# Altium schematic sheet Port.SchDoc
size A4; SheetNumber: 1; SheetTotal: 1
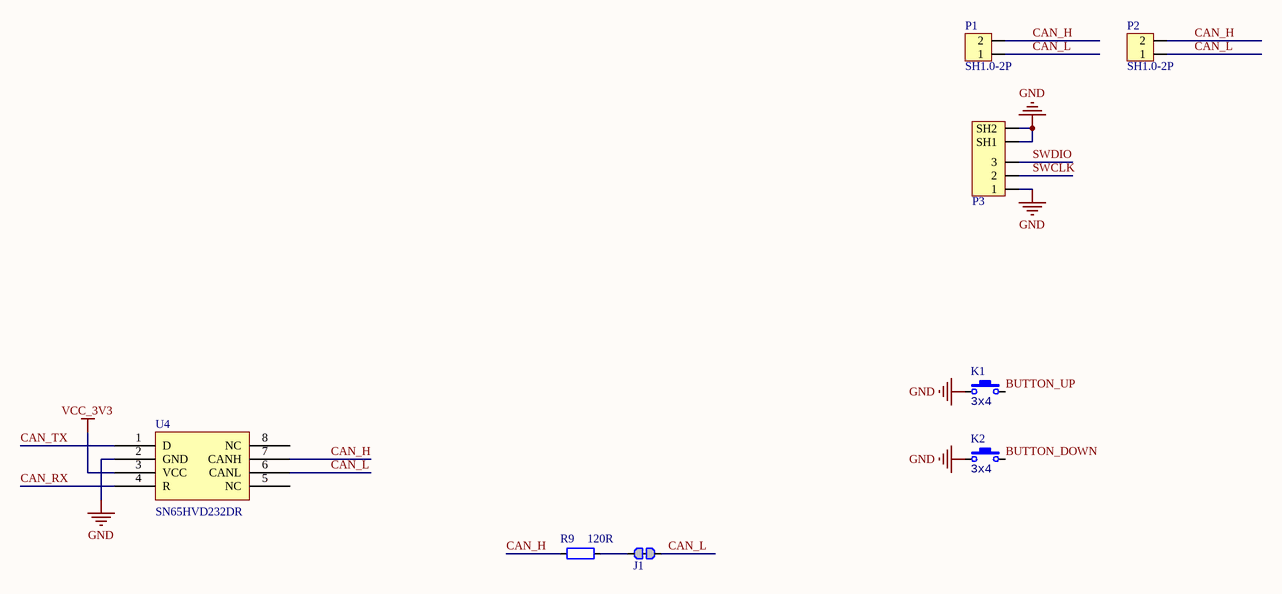
[diagram p0: Port.SchDoc]

## Parts
J1  跳线  [0402-0R]  (value not drawn)
K1  value 3x4  [ButtonTACT_3x4x2_180]  (hidden comment: TACT 2P)
K2  value 3x4  [ButtonTACT_3x4x2_180]  (hidden comment: TACT 2P)
P1  SH1.0-2P  [SH1.0-2P]
P2  SH1.0-2P  [SH1.0-2P]
P3  SH1.0-3P  [SH1.0-3P]  (value not drawn)
R9  120R  [RES_0402]
U4  Manufacturer Part Number: SN65HVD232DR  [SO-8]  (hidden comment: SN65HVD232D)

## Nets
GND: K1.1 K2.1 P3.1 P3.SH1 P3.SH2 U4.2(GND)
VCC_3V3: U4.3(VCC)
BUTTON_DOWN: K2.2
BUTTON_UP: K1.2
CAN_H: P1.2 P2.2 R9.1 U4.7(CANH)
CAN_L: J1.2 P1.1 P2.1 U4.6(CANL)
CAN_RX: U4.4(R)
CAN_TX: U4.1(D)
SWCLK: P3.2
SWDIO: P3.3
NetJ1_1: J1.1 R9.2

Not connected (* = marked no-connect by the designer): U4 5(NC) 8(NC)

## Library data of the parts
J1 = 跳线: Resistor; Published: 8-Jun-2000; LatestRevisionDate: 17-Jul-2002; LatestRevisionNote: Re-released for DXP Platform.; PackageReference: AXIAL-0.4; Publisher: Altium Limited; PackageDescription: Axial Device, Thru-Hole; 2 Leads; 0.4 in Pin Spacing
K1 K2 = ButtonTACT_3x4x2_180: Button; type: TACT 2P
P3 = SH1.0-3P: Header
R9 = 电阻-0402: Resistor; Value: 22R
U4 = SN65HVD232D: Manufacturer: Texas Instruments; Protocol: CAN; Number of Drivers/Receivers: 1/1; Duplex: Half; Data Rate: 1Mbps; Voltage - Supply: 3 V ~ 3.6 V; Supplier 1: Digi-Key; Supplier Part Number 1: 296-26344-2-ND; RoHS: RoHS Compliant; Category: Integrated Circuits (ICs); Stock: 5000; Pricing 1: 2500=0.84375 (USD); Packaging: Tape & Reel (TR); Part Status: Active; Type: Transceiver; Operating Temperature: -40°C ~ 85°C; Mounting Type: Surface Mount; Package / Case: 8-SOIC (0.154", 3.90mm Width); Supplier Device Package: 8-SOIC; ComponentLink1URL: http://www.ti.com/lit/ds/symlink/sn65hvd230.pdf; ComponentLink1Description: http://www.ti.com/lit/ds/symlink/sn65hvd230.pdf; Supplier 2: Digi-Key; Supplier Part Number 2: 296-26344-1-ND; Pricing 2: 1=2.05, 10=1.842, 100=1.4809, 500=1.21668, 1000=1.00811 (USD)